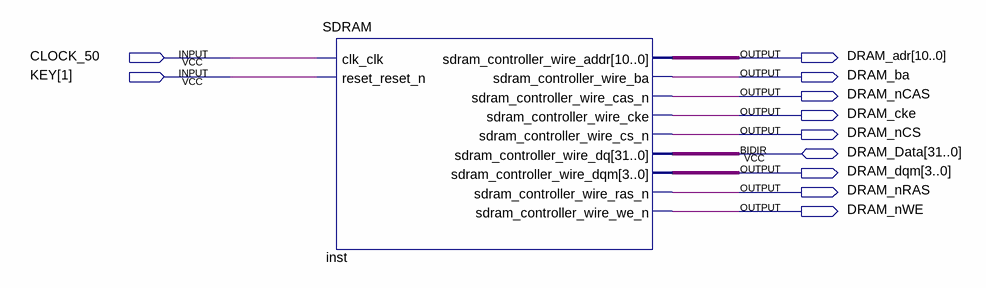
[diagram p0: schematic sheet]
// Quartus schematic Avalon_SDRAM.bdf as structural Verilog: 1 symbols, 11 pins
module Avalon_SDRAM (
  input  CLOCK_50,
  input  [1:1] KEY,
  inout  [31:0] DRAM_Data,
  output [10:0] DRAM_adr,
  output DRAM_ba,
  output DRAM_nCAS,
  output DRAM_cke,
  output DRAM_nCS,
  output [3:0] DRAM_dqm,
  output DRAM_nRAS,
  output DRAM_nWE
);

  SDRAM inst (
    .clk_clk(CLOCK_50), .reset_reset_n(KEY[1]), .sdram_controller_wire_addr(DRAM_adr),
    .sdram_controller_wire_ba(DRAM_ba), .sdram_controller_wire_cas_n(DRAM_nCAS),
    .sdram_controller_wire_cke(DRAM_cke), .sdram_controller_wire_cs_n(DRAM_nCS),
    .sdram_controller_wire_dqm(DRAM_dqm), .sdram_controller_wire_ras_n(DRAM_nRAS),
    .sdram_controller_wire_we_n(DRAM_nWE), .sdram_controller_wire_dq(DRAM_Data));
endmodule
